# Altium project Panel.PrjPCB
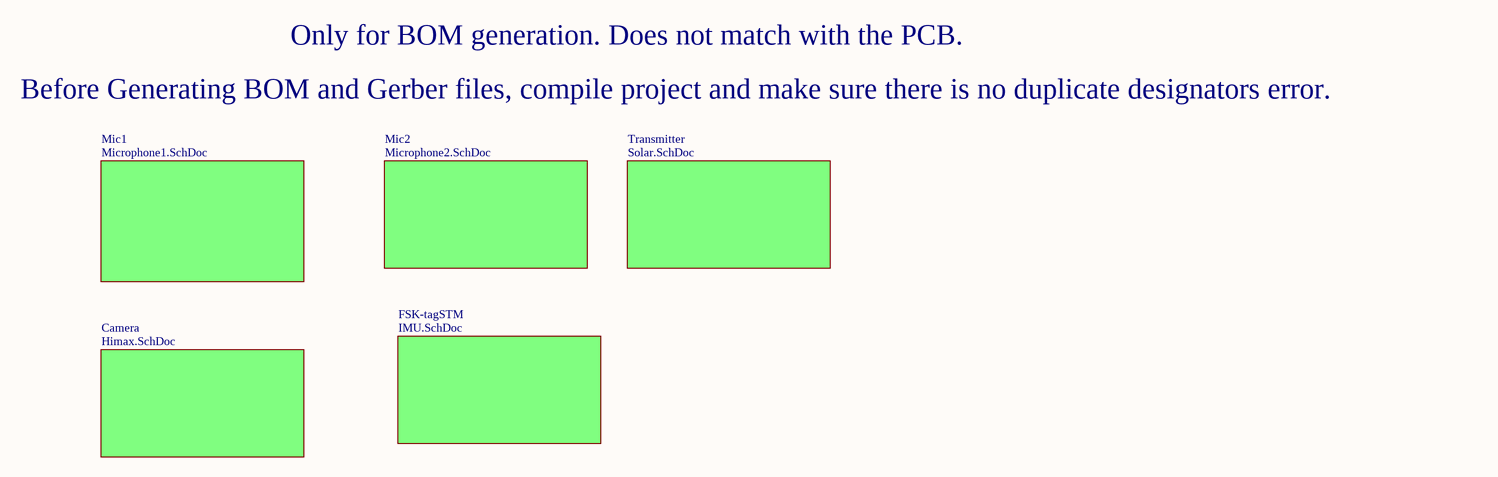
[diagram p0: Tag-panel.SchDoc]
6 sheets, 106 parts. Net scope: flat (ports and power ports of the same name join across sheets).
Board files: Tag-Panel-V.PcbDoc, IMU.PcbDoc, Himax.PcbDoc, Microphone1.PcbDoc, Microphone2.PcbDoc, Solar.PcbDoc
Sheets:
  Tag-panel.SchDoc
    FSK-tagSTM = IMU.SchDoc
    Transmitter = Solar.SchDoc
    Camera = Himax.SchDoc
    Mic2 = Microphone2.SchDoc
    Mic1 = Microphone1.SchDoc

## Sheet Tag-panel.SchDoc
size Letter; Author: Mohamad Katanbaf; Organization: University of Washington; Address1: Sensor Systems Lab; Address2: Paul Allen Center,; Address3: 185 E Stevens Way NE; Address4: Seattle, WA, 98105; Revision: 1.0

### Sub-sheets
Camera = Himax.SchDoc: no entries
FSK-tagSTM = IMU.SchDoc: no entries
Mic1 = Microphone1.SchDoc: no entries
Mic2 = Microphone2.SchDoc: no entries
Transmitter = Solar.SchDoc: no entries

### Notes on the sheet
- Only for BOM generation. Does not match with the PCB.
- Before Generating BOM and Gerber files, compile project and make sure there is no duplicate designators error.
- Title
- Date:
- Project
- Revision:
- Sheet
- of
- Author:

## Sheet IMU.SchDoc: ICM20602 Test Board
size Letter; Author: Mohamad Katanbaf; Organization: University of Washington; Address1: Sensor Systems Lab; Address2: Paul Allen Center,; Address3: 185 E Stevens Way NE; Address4: Seattle, WA, 98105; Revision: 1.0; SheetNumber: 1; SheetTotal: 1
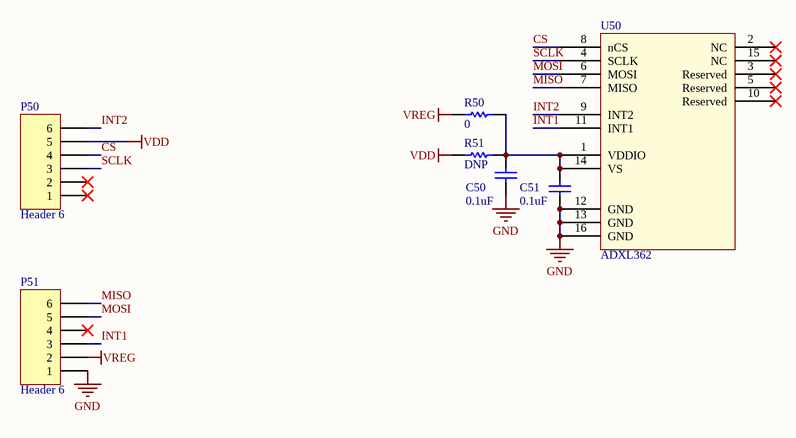
[diagram p1: IMU.SchDoc]

### Parts
C50  value 0.1uF  [0402]  (hidden comment: Generic ceramic capacitor)
C51  value 0.1uF  [0402]  (hidden comment: Generic ceramic capacitor)
P50  Header 6  [HDR1X6]
P51  Header 6  [HDR1X6]
R50  value 0  [0402]  (hidden comment: Generic resistor)
R51  value DNP  [0402]  (hidden comment: Generic resistor)
U50  ADXL362  [ADXL362]

### Nets
GND: C50.1 C51.1 P51.1 U50.12(GND) U50.13(GND) U50.16(GND)
VDD: P50.5 R51.1
VREG: P51.2 R50.1
CS: P50.4 U50.8(nCS)
INT1: P51.3 U50.11(INT1)
INT2: P50.6 U50.9(INT2)
MISO: P51.6 U50.7(MISO)
MOSI: P51.5 U50.6(MOSI)
SCLK: P50.3 U50.4(SCLK)
NetC50_2: C50.2 C51.2 R50.2 R51.2 U50.1(VDDIO) U50.14(VS)

Not connected (* = marked no-connect by the designer): P50 1* 2*; P51 4*; U50 2(NC)* 3(Reserved)* 5(Reserved)* 10(Reserved)* 15(NC)*

### Notes on the sheet
- Title
- Date:
- Project
- Revision:
- Sheet
- of
- Author:

### Library data of the parts
C50 C51 = C-0.1uF-10V-X5R-0402: CAP CER 100nF/0.1UF 10V X5R 0402; Manufacturer: Samsung Electro-Mechanics; Manufacturer Part Number: CL05A104KP5NNNC; Rating: 10V, -55C~85C; Tolerance: +-10%; Digi-Key Part Number: 1276-1022-1-ND; Note: *
P50 P51 = Header 6: Header, 6-Pin; LatestRevisionDate: 17-Jul-2002; LatestRevisionNote: Re-released for DXP Platform.; Publisher: Altium Limited
R50 = R-0-0.063W-*-0402: RES 0 OHM JUMPER 1/16W 0402; Manufacturer: YAGEO; Manufacturer Part Number: RC0402JR-070RL; Digi-Key Part Number: 311-0.0JRCT-ND; Rating: 1/16W; Note: *; Tolerance: *
R51 = res: Chip Resistor (Surface Mount); Manufacturer: *; Manufacturer Part Number: *; Digi-Key Part Number: *; Rating: *; Note: *; Tolerance: *
U50 = ADXL362: Analog Devices low power accelerometer; Manufacturer: Analog Devices Inc.; Manufacturer Part Number: ADXL362BCCZ-RL; Rating: 1.6~3.5V, -40~85C; Digi-Key Part Number: 505-ADXL362BCCZ-RLCT-ND; Note: *

## Sheet Solar.SchDoc: Dual Harvester
size Letter; Author: Ali Saffari; Organization: University of Washington; Address1: Sensor Systems Lab; SheetNumber: 1; SheetTotal: 3
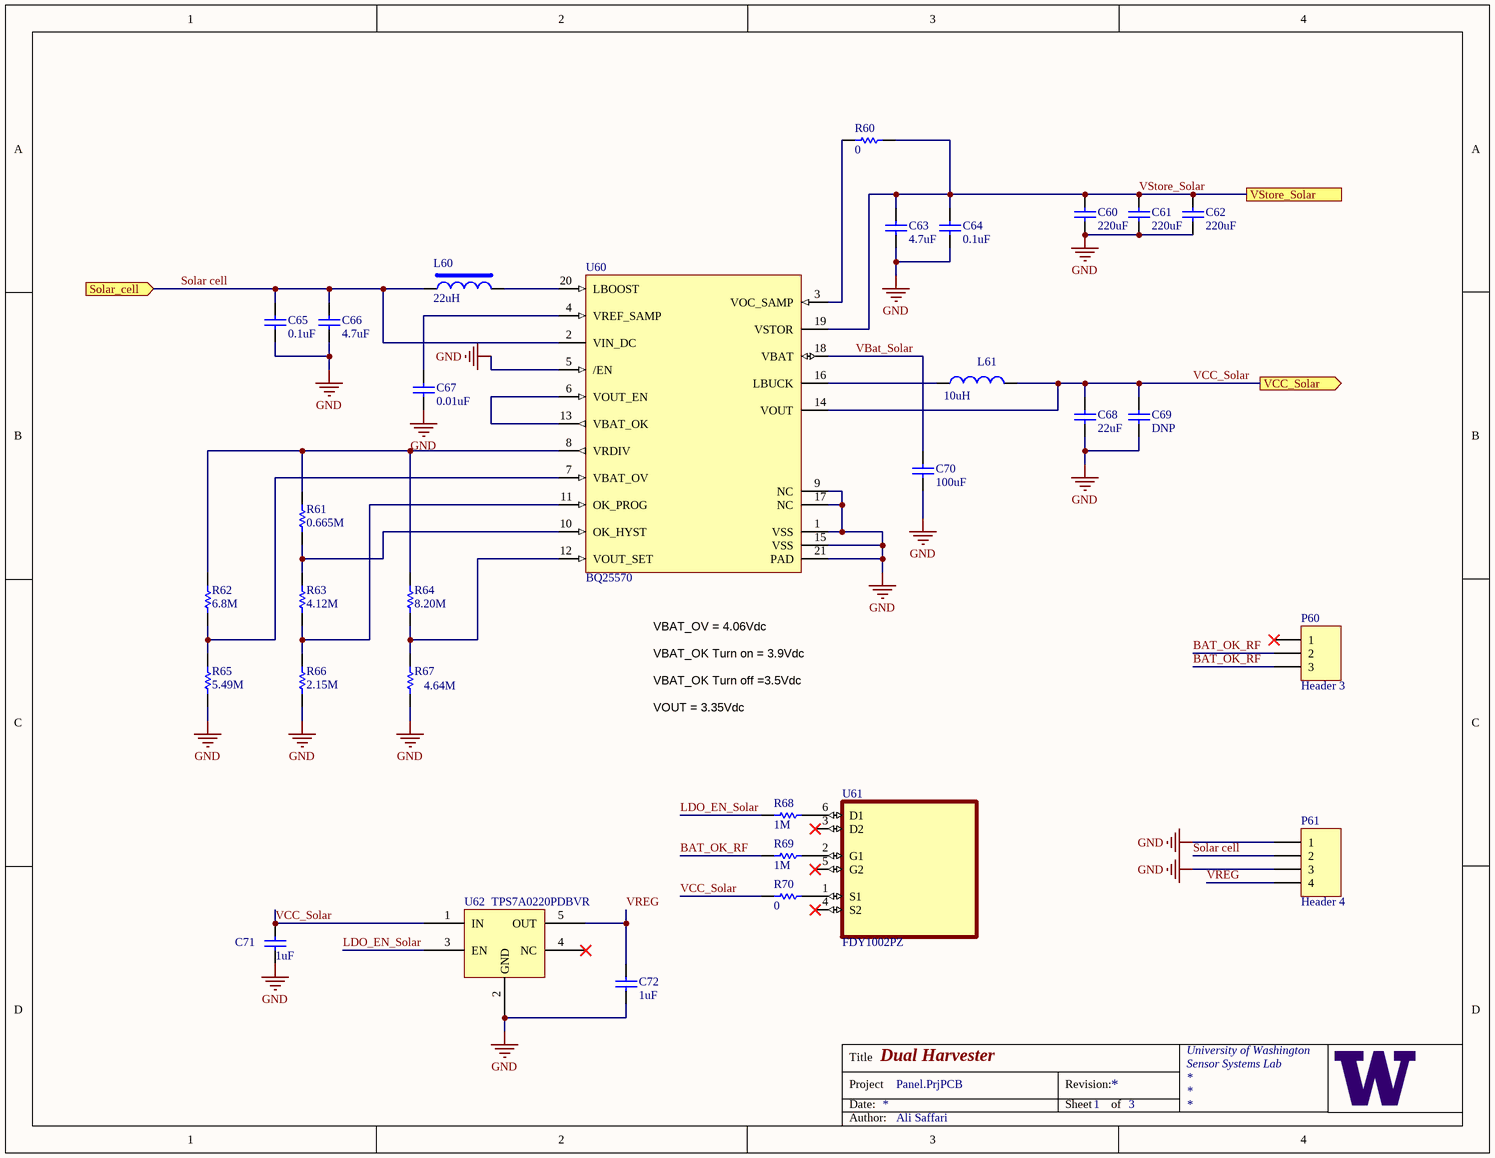
[diagram p2: Solar.SchDoc]

### Parts
C60  220uF  [1206]
C61  220uF  [1206]
C62  220uF  [1206]
C63  4.7uF  [0402]
C64  0.1uF  [0402]
C65  0.1uF  [0402]
C66  4.7uF  [0402]
C67  0.01uF  [0402]
C68  22uF  [0402]
C69  DNP  [0402]
C70  100uF  [0805]
C71  value 1uF  [0402]  (hidden comment: Cap)
C72  value 1uF  [0402]  (hidden comment: Cap)
L60  value 22uH  [LPS4018]  (hidden comment: Ind_LPS4018)
L61  10uH  [IND1008]
P60  Header 3  [HDR1X3]
P61  Header 4  [HDR1X4]
R60  0  [0402]
R61  0.665M  [0402]
R62  6.8M  [0402]
R63  4.12M  [0402]
R64  8.20M  [0402]
R65  5.49M  [0402]
R66  2.15M  [0402]
R67  4.64M  [0402]
R68  1M  [0402]
R69  1M  [0402]
R70  0  [0402]
U60  BQ25570  [BQ25570]
U61  FDY1002PZ  [SOT50P160X60-6N]
U62  TPS7A0220PDBVR  [SOT23-5]

### Ports
Solar_cell (in), VCC_Solar (out), VStore_Solar

### Nets
GND: C60.1 C61.1 C62.1 C63.1 C64.1 C65.1 C66.1 C67.1 C68.1 C69.1 C70.1 C71.1 C72.1 P61.1 P61.3 R65.2 R66.2 R67.2 U60.1(VSS) U60.5(/EN) U60.9(NC) U60.15(VSS) U60.17(NC) U60.21(PAD) U62.2(GND)
BAT_OK_RF: P60.2 P60.3 R69.1
LDO_EN_Solar: R68.1 U62.3(EN)
Solar cell: C65.2 C66.2 L60.1 P61.2 U60.2(VIN_DC) ; port Solar_cell
VBat_Solar: C70.2 U60.18(VBAT)
VCC_Solar: C68.2 C69.2 C71.2 L61.2 R70.1 U60.14(VOUT) U62.1(IN) ; port VCC_Solar
VREG: C72.2 P61.4 U62.5(OUT)
VStore_Solar: C60.2 C61.2 C62.2 C63.2 C64.2 R60.2 U60.19(VSTOR) ; port VStore_Solar
NetC67_2: C67.2 U60.4(VREF_SAMP)
NetL60_2: L60.2 U60.20(LBOOST)
NetL61_1: L61.1 U60.16(LBUCK)
NetR60_1: R60.1 U60.3(VOC_SAMP)
NetR61_1: R61.1 R62.1 R64.1 U60.8(VRDIV)
NetR61_2: R61.2 R63.1 U60.10(OK_HYST)
NetR62_2: R62.2 R65.1 U60.7(VBAT_OV)
NetR63_2: R63.2 R66.1 U60.11(OK_PROG)
NetR64_2: R64.2 R67.1 U60.12(VOUT_SET)
NetR68_2: R68.2 U61.6(D1)
NetR69_2: R69.2 U61.2(G1)
NetR70_2: R70.2 U61.1(S1)
NetU60_6: U60.6(VOUT_EN) U60.13(VBAT_OK)

Not connected (* = marked no-connect by the designer): P60 1*; U61 3(D2)* 4(S2)* 5(G2)*; U62 4(NC)*

### Notes on the sheet
- VBAT_OV = 4.06Vdc
- VBAT_OK Turn on = 3.9Vdc
- VBAT_OK Turn off =3.5Vdc
- VOUT = 3.35Vdc
- Title
- Date:
- Project
- Revision:
- Sheet
- of
- Author:

### Library data of the parts
C60-C62 = Cap: Ceramic Capacitor (Surface Mount); Manufacturer: Murata Electronics; Manufacturer Part Number: GRM31CR60J227ME11L; Rating: 6.3V; Note: CAP CER 220UF 6.3V X5R 1206; Digi-Key Part Number: 490-13970-1-ND; Value: 220uF
C63 C66 C67 = Cap: Ceramic Capacitor (Surface Mount); Manufacturer: Murata Electronics; Manufacturer Part Number: GRM155R61A475MEAAD; Rating: 10V; Note: CAP CER 4.7UF 10V X5R 0402; Digi-Key Part Number: 490-14306-1-ND
  C63 C66: Value: 4.7uF
  C67: Value: 0.01uF
C64 C65 = Cap: Ceramic Capacitor (Surface Mount); Manufacturer: Murata Electronics North America; Manufacturer Part Number: GCM155R71C104KA55D; Rating: 16V; Note: CAP CER 0.1UF 16V X7R 0402; Digi-Key Part Number: 490-4759-1-ND; Value: 0.1uF
C68 C69 = Cap: Ceramic Capacitor (Surface Mount); Manufacturer: Murata Electronics; Manufacturer Part Number: GRM188R61A226ME15D; Rating: 10V; Note: CAP CER 22UF 10V X5R 0603; Digi-Key Part Number: 490-10476-1-ND
  C68: Value: 22uF
  C69: Value: DNP
C70 = Cap: Ceramic Capacitor (Surface Mount); Manufacturer: Murata Electronics; Manufacturer Part Number: GRM21BR60J107ME15L; Rating: 6.3V; Note: CAP CER 100UF 6.3V X5R 0805; Digi-Key Part Number: 490-13981-1-ND; Value: 100uF
C71 C72 = Cap: Ceramic Capacitor (Surface Mount); Manufacturer: Generic Ceramic Chip Cap (TBD); Digi-Key Part Number: *; Manufacturer Part Number: *; Note: *; Rating: *
L60 = Ind_LPS4018: Inductor (Surface Mount); Manufacturer: Coil Craft; Manufacturer Part Number: LPS4018-223MRB; Rating: 0.9A; Note: LPS4018 Low Profile 22uH 0.9A 20% SMD; Digi-Key Part Number: *
L61 = Ind: Inductor (Surface Mount); Manufacturer: Murata Electronics; Manufacturer Part Number: 1239AS-H-100M=P2; Rating: 1A; Note: FIXED IND 10UH 1A 460 MOHM SMD; Value: 10uH; Digi-Key Part Number: 490-10563-1-ND
P60 = Header 3: Header, 3-Pin; LatestRevisionDate: 17-Jul-2002; LatestRevisionNote: Re-released for DXP Platform.; Publisher: Altium Limited
P61 = Header 4: Header, 4-Pin; LatestRevisionDate: 17-Jul-2002; LatestRevisionNote: Re-released for DXP Platform.; Publisher: Altium Limited
R60 R68-R70 = Res: Chip Resistor (Surface Mount); Manufacturer: Yageo; Manufacturer Part Number: RC0402JR-070RL; Rating: 1/16W; Digi-Key Part Number: 311-0.0JRCT-ND
  R60 R70: Value: 0
  R68 R69: Value: 1M
R61 = Res: Chip Resistor (Surface Mount); Manufacturer: Yageo; Manufacturer Part Number: RC0402FR-073M3L; Rating: 1/16W; Digi-Key Part Number: 311-3.30MLRCT-ND; Value: 0.665M
R62 R64 = Res: Chip Resistor (Surface Mount); Manufacturer: Vishay Dale; Manufacturer Part Number: CRCW04026M80JNED; Rating: 1/16W; Digi-Key Part Number: 541-6.8MJCT-ND
  R62: Value: 6.8M
  R64: Value: 8.20M
R63 R65 R67 = Res: Chip Resistor (Surface Mount); Manufacturer: Vishay Dale; Manufacturer Part Number: CRCW04025M49FKED; Rating: 1/16W; Digi-Key Part Number: 541-5.49MLCT-ND
  R63: Value: 4.12M
  R65: Value: 5.49M
  R67: Value: 4.64M
R66 = Res: Chip Resistor (Surface Mount); Manufacturer: Vishay Dale; Manufacturer Part Number: CRCW04024M22FKED; Rating: 1/16W; Digi-Key Part Number: 541-4.22MLCT-ND; Value: 2.15M
U60 = BQ25570: nano power boost charger and buck converter / for energy harvester powered applications; Manufacturer: Texas Instruments; Manufacturer Part Number: BQ25570RGRT; Output Current: 100mA; Operating Supply Current: 488nA; Min Supply Voltage: 100mV; Max Supply Voltage: 5.1V; Switching Frequency: 1MHz; Digi-Key Part Number: 296-37014-1-ND; Supplier 1: Digi-Key; Stock 1: 2223; Pricing 1: 1=7.94, 10=7.171, 25=6.8372, 100=5.6697 (USD); Mount: Surface Mount; Case/Package: VQFN; Number of Pins: 20; Contact Plating: Gold; Min Operating Temperature: -40°C; Max Operating Temperature: 125°C; Package Quantity: 250; Packaging: Tape and Reel; Radiation Hardening: No; REACH SVHC: No SVHC; Lead Free: Lead Free; ComponentLink1URL: http://www.mouser.com/ds/2/405/bq25570-556801.pdf?src-supplier=Mouser; ComponentLink1Description: http://www.mouser.com/ds/2/405/bq25570-556801.pdf?src-supplier=Mouser; ComponentLink2URL: http://www.ti.com/lit/pdf/sluuaa7?src-supplier=Digi-Key; ComponentLink2Description: http://www.ti.com/lit/pdf/sluuaa7?src-supplier=Digi-Key; ComponentLink3URL: http://www.farnell.com/datasheets/1904809.pdf?src-supplier=Element14; ComponentLink3Description: http://www.farnell.com/datasheets/1904809.pdf?src-supplier=Element14; ComponentLink4URL: http://www.ti.com/lit/ds/symlink/bq25570.pdf?src-supplier=Digi-Key; ComponentLink4Description: http://www.ti.com/lit/ds/symlink/bq25570.pdf?src-supplier=Digi-Key; ComponentLink5URL: http://www.ti.com/lit/ds/symlink/bq25570.pdf?src-supplier=Avnet; ComponentLink5Description: http://www.ti.com/lit/ds/symlink/bq25570.pdf?src-supplier=Avnet; ComponentLink6URL: http://www.ti.com/general/docs/lit/getliterature.tsp?genericPartNumber=BQ25570&&fileType=pdf&src-supplier=Avnet; ComponentLink6Description: http://www.ti.com/general/docs/lit/getliterature.tsp?genericPartNumber=BQ25570&&fileType=pdf&src-supplier=Avnet; Supplier Part Number 1: 296-37014-1-ND
U61 = FDY1002PZ: Mosfet Array 2 P-Channel (Dual) 20V 830mA 446mW Surface Mount SOT-563F; MF: ON Semiconductor; Value: *; Check_prices: https://www.snapeda.com/parts/FDY1002PZ/Onsemi/view-part/?ref=eda; Availability: In Stock; Price: None; MP: FDY1002PZ; Package: SOT-563-6 ON Semiconductor; SnapEDA_Link: https://www.snapeda.com/parts/FDY1002PZ/Onsemi/view-part/?ref=snap; Purchase-URL: https://pricing.snapeda.com/search/part/FDY1002PZ/?ref=eda
U62 = TPS7A0218PDBVR: IC REG LINEAR 2V 200MA SOT23-5

## Sheet Himax.SchDoc: Himax Camera
size Letter; Author: Ali Saffari; Organization: University of Washington; Address1: Sensor Systems Lab; Revision: 2; SheetNumber: 1; SheetTotal: 1
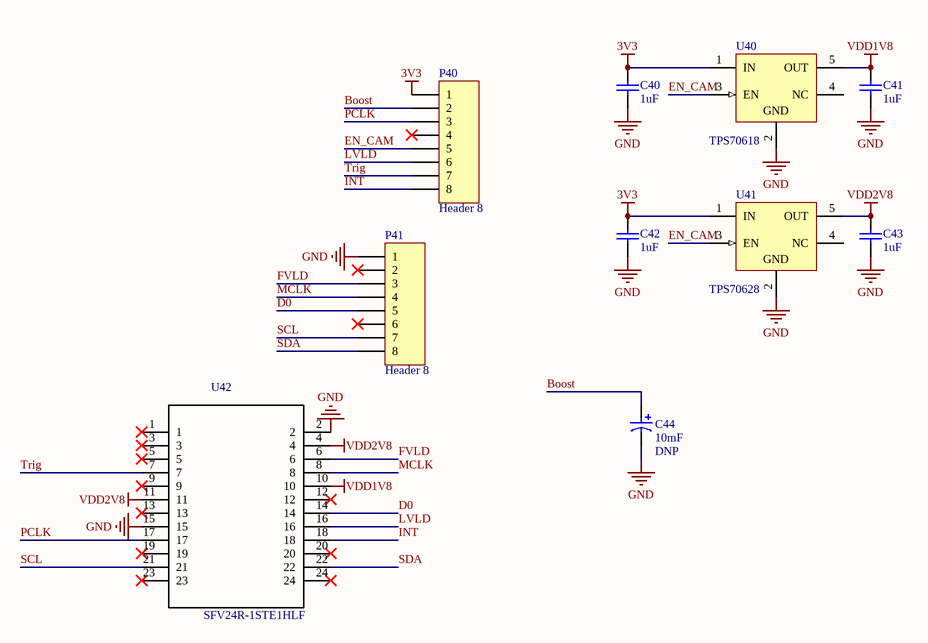
[diagram p3: Himax.SchDoc]

### Parts
C40  value 1uF  [0402]  (hidden comment: Generic ceramic capacitor)
C41  value 1uF  [0402]  (hidden comment: Generic ceramic capacitor)
C42  value 1uF  [0402]  (hidden comment: Generic ceramic capacitor)
C43  value 1uF  [0402]  (hidden comment: Generic ceramic capacitor)
C44  value DNP  Note: 10mF  [CAPPRD500W60D1000H3200]  (hidden comment: Generic electrolytic capacitor)
P40  Header 8  [HDR1X8]
P41  Header 8  [HDR1X8]
U40  TPS70618  [TI-DDC5_M]
U41  TPS70628  [TI-DDC5_M]
U42  SFV24R-1STE1HLF  [FCI_SFV24R-2STE1LF]

### Nets
3V3: C40.2 C42.2 P40.1 U40.1(IN) U41.1(IN)
GND: C40.1 C41.1 C42.1 C43.1 C44.N P41.1 U40.2(GND) U41.2(GND) U42.2 U42.15
VDD1V8: C41.2 U40.5(OUT) U42.10
VDD2V8: C43.2 U41.5(OUT) U42.4 U42.11
Boost: C44.P P40.2
D0: P41.5 U42.14
EN_CAM: P40.5 U40.3(EN) U41.3(EN)
FVLD: P41.3 U42.6
INT: P40.8 U42.18
LVLD: P40.6 U42.16
MCLK: P41.4 U42.8
PCLK: P40.3 U42.17
SCL: P41.7 U42.21
SDA: P41.8 U42.22
Trig: P40.7 U42.7

Not connected (* = marked no-connect by the designer): P40 4*; P41 2* 6*; U40 4(NC); U41 4(NC); U42 1* 3* 5* 9* 12* 13* 19* 20* 23* 24*

### Notes on the sheet
- Title
- Date:
- Project
- Revision:
- Sheet
- of
- Author:

### Library data of the parts
C40-C43 = C-1uF-10V-X5R-0402: CAP CER 1UF 10V X5R 0402; Manufacturer: Samsung Electro-Mechanics; Manufacturer Part Number: CL05A105KP5NNNC; Rating: 10V, -55~85C; Tolerance: +-10%; Digi-Key Part Number: 1276-1076-1-ND; Note: *
C44 = cap_electrolytic: Electrolytic capacitor; Digi-Key Part Number: *; Manufacturer: *; Manufacturer Part Number: *; Rating: *; Tolerance: *
P40 P41 = Header 8: Header, 8-Pin; LatestRevisionDate: 17-Jul-2002; LatestRevisionNote: Re-released for DXP Platform.; Publisher: Altium Limited
U40 = TPS706xx: Linear Voltage Regulator IC Positive Fixed 1 Output 150mA SOT-23-5; Manufacturer: Texas Instruments; Manufacturer Part Number: TPS70618DBVR; Number of Regulators: 1; Min Current Limit: 200mA; Quiescent Current: 1.3uA; Dropout Voltage: 245mV; Min Input Voltage: 2.7V; Max Input Voltage: 6.5V; Accuracy: 2%; ComponentLink3URL: http://www.ti.com/litv/pdf/mpds123d; ComponentLink1Description: Manufacturer URL; ComponentLink2URL: http://www.ti.com/general/docs/lit/getliterature.tsp?genericPartNumber=TPS78001&fileType=pdf; ComponentLink3Description: Package Specification; ComponentLink1URL: http://www.ti.com/; ComponentLink2Description: Datasheet; Mount: Surface Mount; Case/Package: SOT-23-5; Number of Pins: 5; Contact Plating: Gold; Min Operating Temperature: -40°C; Max Operating Temperature: 125°C; Packaging: Cut Tape; Output Voltage: *; Output Current: 150mA; Output Type: Fixed; Polarity: Positive; Number of Outputs: 1; Max Output Current: 150mA; Lead Free: Lead Free; REACH SVHC: No SVHC; Digi-Key Part Number: 296-47896-1-ND
U41 = TPS706xx: Linear Voltage Regulator IC Positive Fixed 1 Output 150mA SOT-23-5; Manufacturer: Texas Instruments; Manufacturer Part Number: TPS70628DBVR; Number of Regulators: 1; Min Current Limit: 200mA; Quiescent Current: 1.3uA; Dropout Voltage: 245mV; Min Input Voltage: 2.7V; Max Input Voltage: 6.5V; Accuracy: 2%; ComponentLink3URL: http://www.ti.com/litv/pdf/mpds123d; ComponentLink1Description: Manufacturer URL; ComponentLink2URL: http://www.ti.com/general/docs/lit/getliterature.tsp?genericPartNumber=TPS78001&fileType=pdf; ComponentLink3Description: Package Specification; ComponentLink1URL: http://www.ti.com/; ComponentLink2Description: Datasheet; Mount: Surface Mount; Case/Package: SOT-23-5; Number of Pins: 5; Contact Plating: Gold; Min Operating Temperature: -40°C; Max Operating Temperature: 125°C; Packaging: Cut Tape; Output Voltage: *; Output Current: 150mA; Output Type: Fixed; Polarity: Positive; Number of Outputs: 1; Max Output Current: 150mA; Lead Free: Lead Free; REACH SVHC: No SVHC; Digi-Key Part Number: 296-50141-1-ND
U42 = SFV24R-1STE1HLF: Himax Camera Connector; Manufacturer: Amphenol FCI; Actuator Material: Glass,Polyphenylene; Number of Contacts: 24; Contact Resistance: 30mR; Current Rating: 500mA; Voltage Rating: 50V; Contact Location: Bottom; Insulation Resistance: 100MR; Wire/Cable Type: Straight; Pitch: 0.5mm; Supplier 1: Digi-Key; Manufacturer Part Number: SFV24R-1STE1HLF; Stock 1: 0; Pricing 1: 1=0.76, 10=0.67, 25=0.6308, 50=0.6044, 100=0.5782, 250=0.5256, 500=0.47304, 1000=0.42048 (USD); Mount: Surface Mount; Contact Material: Bronze; Contact Plating: Tin; Housing Color: Black; Housing Material: Polymer; Min Operating Temperature: -55°C; Max Operating Temperature: 105°C; Number of Rows: 1; Termination: Solder; Orientation: Right Angle; Packaging: Tape and Reel; Package Quantity: 3000; Number of Positions: 24; Max Voltage Rating (AC): 50V; Max Voltage Rating (DC): 50V; Length: 17.5mm; Depth: 4.9mm; Radiation Hardening: No; Lead Free: Lead Free; Flammability Rating: UL94 V-0; ComponentLink1URL: http://portal.fciconnect.com/Comergent/fci/drawing/10112793.pdf?src-supplier=Avnet; ComponentLink1Description: http://portal.fciconnect.com/Comergent/fci/drawing/10112793.pdf?src-supplier=Avnet; ComponentLink2URL: https://cdn.amphenol-icc.com/media/wysiwyg/files/drawing/10112793.pdf?src-supplier=Digi-Key; ComponentLink2Description: https://cdn.amphenol-icc.com/media/wysiwyg/files/drawing/10112793.pdf?src-supplier=Digi-Key; ComponentLink3URL: http://portal.fciconnect.com/Comergent//fci/drawing/10112793.pdf?src-supplier=Mouser; ComponentLink3Description: http://portal.fciconnect.com/Comergent//fci/drawing/10112793.pdf?src-supplier=Mouser; Supplier Part Number 1: 609-4320-1-ND

## Sheet Microphone2.SchDoc: Microphone
size Letter; Author: Ali Saffari; Organization: University of Washinton; Address1: Sensor Systems Lab; Revision: 2; SheetNumber: 1; SheetTotal: 1
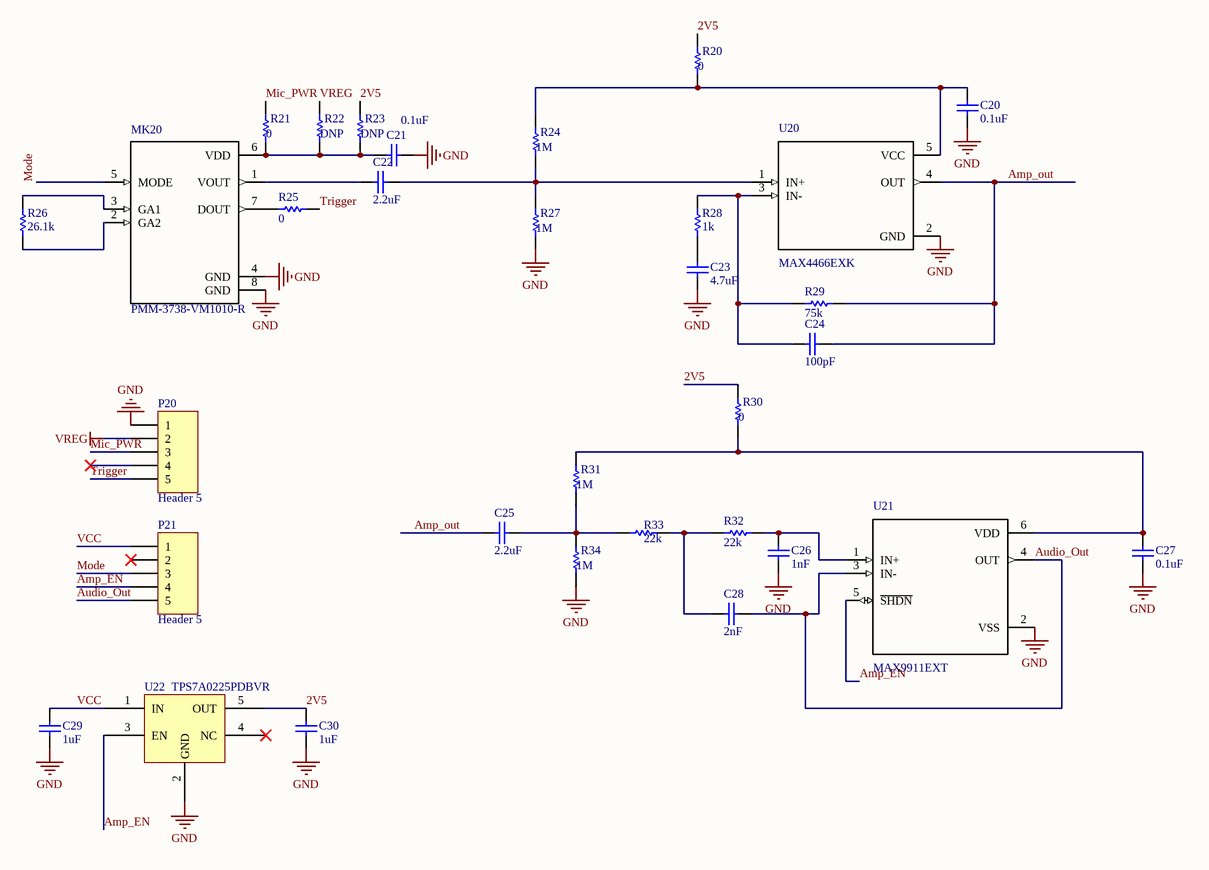
[diagram p4: Microphone2.SchDoc]

### Parts
C20  0.1uF  [0402]
C21  0.1uF  [0402]
C22  2.2uF  [0402]
C23  4.7uF  [0402]
C24  100pF  [0402]
C25  2.2uF  [0402]
C26  1nF  [0402]
C27  0.1uF  [0402]
C28  2nF  [0402]
C29  1uF  [0402]
C30  1uF  [0402]
MK20  PMM-3738-VM1010-R  [MIC_PMM-3738-VM1010-R]
P20  Header 5  [HDR1X5]
P21  Header 5  [HDR1X5]
R20  0  [0402]
R21  0  [0402]
R22  DNP  [0402]
R23  DNP  [0402]
R24  1M  [0402]
R25  0  [0402]
R26  26.1k  [0402]
R27  1M  [0402]
R28  1k  [0402]
R29  75k  [0402]
R30  0  [0402]
R31  1M  [0402]
R32  22k  [0402]
R33  22k  [0402]
R34  1M  [0402]
U20  MAX4466EXK  [SOT65P210X110-5N]
U21  MAX9911EXT  [MAX9911EXT]
U22  TPS7A0225PDBVR  [SOT23-5]

### Nets
GND: C20.2 C21.2 C23.1 C26.2 C27.1 C29.1 C30.1 MK20.4(GND) MK20.8(GND) P20.1 R27.2 R34.1 U20.2(GND) U21.2(VSS) U22.2(GND)
VREG: P20.2 R22.1
2V5: C30.2 R20.1 R23.1 R30.1 U22.5(OUT)
Amp_EN: P21.4 U21.5(~{SHDN}) U22.3(EN)
Amp_out: C24.1 C25.1 R29.2 U20.4(OUT)
Audio_Out: C28.1 P21.5 U21.3(IN-) U21.4(OUT)
Mic_PWR: P20.3 R21.1
Mode: MK20.5(MODE) P21.3
Trigger: P20.5 R25.2
VCC: C29.2 P21.1 U22.1(IN)
NetC20_1: C20.1 R20.2 R24.1 U20.5(VCC)
NetC21_1: C21.1 MK20.6(VDD) R21.2 R22.2 R23.2
NetC22_1: C22.1 MK20.1(VOUT)
NetC22_2: C22.2 R24.2 R27.1 U20.1(IN+)
NetC23_2: C23.2 R28.2
NetC24_2: C24.2 R28.1 R29.1 U20.3(IN-)
NetC25_2: C25.2 R31.1 R33.1 R34.2
NetC26_1: C26.1 R32.2 U21.1(IN+)
NetC27_2: C27.2 R30.2 R31.2 U21.6(VDD)
NetC28_2: C28.2 R32.1 R33.2
NetMK20_2: MK20.2(GA2) R26.2
NetMK20_3: MK20.3(GA1) R26.1
NetMK20_7: MK20.7(DOUT) R25.1

Not connected (* = marked no-connect by the designer): P20 4*; P21 2*; U22 4(NC)*

### Notes on the sheet
- Title
- Date:
- Project
- Revision:
- Sheet
- of
- Author:

### Library data of the parts
C20 C21 C27 = Cap: Ceramic Capacitor (Surface Mount); Manufacturer: Murata Electronics North America; Manufacturer Part Number: GCM155R71C104KA55D; Note: CAP CER 0.1UF 16V X7R 0402; Rating: 16V; Digi-Key Part Number: 490-4759-1-ND; Value: 0.1uF
C22 C25 C29 C30 = Cap: Ceramic Capacitor (Surface Mount); Manufacturer: Yageo; Manufacturer Part Number: RC0402JR-070RL; Digi-Key Part Number: 311-0.0JRCT-ND; Note: *; Rating: *
  C22 C25: Value: 2.2uF
  C29 C30: Value: 1uF
C23 = Cap: Ceramic Capacitor (Surface Mount); Manufacturer: Murata Electronics; Manufacturer Part Number: GRM155R61A475MEAAD; Note: CAP CER 4.7UF 10V X5R 0402; Rating: 10V; Digi-Key Part Number: 490-14306-1-ND; Value: 4.7uF
C24 = Cap: Ceramic Capacitor (Surface Mount); Manufacturer: Yageo; Manufacturer Part Number: CC0402JRNPO9BN101; Digi-Key Part Number: 311-1024-1-ND; Note: *; Rating: *; Value: 100pF
C26 = Cap: Ceramic Capacitor (Surface Mount); Manufacturer: Murata Electronics; Manufacturer Part Number: GCM155R71H102KA37D; Note: CAP CER 1000PF 50V X7R 0402; Rating: 50V; Digi-Key Part Number: 490-4761-1-ND; Value: 1nF
C28 = Cap: Ceramic Capacitor (Surface Mount); Manufacturer: AVX Corporation; Manufacturer Part Number: 04025C202JAT2A; Digi-Key Part Number: 478-10122-1-ND; Note: *; Rating: *; Value: 2nF
MK20 = PMM-3738-VM1010-R: MEMS Microphone Omni-Directional 700 Ohm -38dBV 1.8V Rectangular Solder Pad T/R; Manufacturer Part Number: VM1010; Manufacturer: Vesper Technologies Inc.; Notes: PIEZOELETRIC MEMS MIC SINGLE-END; Digi-Key Part Number: 2022-1001-1-ND
P20 P21 = Header 5: Header, 5-Pin; LatestRevisionDate: 17-Jul-2002; LatestRevisionNote: Re-released for DXP Platform.; Publisher: Altium Limited
R20-R23 R30 = Res: Chip Resistor (Surface Mount); Manufacturer: Yageo; Manufacturer Part Number: RC0402FR-071ML; Digi-Key Part Number: 311-1.00MLRCT-ND; Rating: *
  R20 R21 R30: Value: 0
  R22 R23: Value: DNP
R24 R27 R31 R34 = Res: Chip Resistor (Surface Mount); Manufacturer: Yageo; Manufacturer Part Number: RC0402FR-071ML; Value: DNP; Digi-Key Part Number: 311-1.00MLRCT-ND; Rating: *
R25 = Res: Chip Resistor (Surface Mount); Manufacturer: Yageo; Manufacturer Part Number: RC0402JR-070RL; Digi-Key Part Number: 311-0.0JRCT-ND; Rating: *; Value: 0
R26 = Res: Chip Resistor (Surface Mount); Manufacturer: Yageo; Manufacturer Part Number: RC0402FR-0726K1L; Digi-Key Part Number: 311-26.1KLRCT-ND; Rating: *; Value: 26.1k
R28 = Res: Chip Resistor (Surface Mount); Manufacturer: Yageo; Manufacturer Part Number: RC0402FR-071KL; Digi-Key Part Number: 311-1.00KLRCT-ND; Rating: *; Value: 1k
R29 = Res: Chip Resistor (Surface Mount); Manufacturer: Yageo; Manufacturer Part Number: RC0402FR-0775KL; Digi-Key Part Number: 311-75KLRCT-ND; Rating: *; Value: 75k
R32 R33 = Res: Chip Resistor (Surface Mount); Manufacturer: Yageo; Manufacturer Part Number: RT0402BRD0722KL; Digi-Key Part Number: YAG4210CT-ND; Rating: *; Value: 22k
U20 = MAX4466EXK: Audio Amp Microphone 1-CH Mono Class-AB 5-Pin SC70; Manufacturer: Maxim Integrated; Manufacturer Part Number: MAX4466EXK+T; Min Supply Voltage: 2.4V; Max Supply Voltage: 5.5V; Power Supply Rejection Ratio (PSRR): 112dB; Gain Bandwidth Product: 600kHz; Common Mode Rejection Ratio: 80dB; Max Power Dissipation: 200mW; Number of Channels: 1; Input Bias Current: 100nA; Input Offset Voltage (Vos): 5V; Supply Type: Single; Supplier 1: Digi-Key; Stock 1: 1912; Pricing 1: 1=0.86, 10=0.752, 25=0.7068, 100=0.5358, 250=0.456, 500=0.4332, 1000=0.3306 (USD); Mount: Surface Mount; Case/Package: SC; Number of Pins: 5; Weight: 0.000705oz; Contact Plating: Tin,Matte; Min Operating Temperature: -40°C; Max Operating Temperature: 85°C; Packaging: Tape and Reel; Package Quantity: 2500; Operating Supply Voltage: 5V; Length: 2mm; Height: 0.9mm; Width: 1.25mm; Radiation Hardening: No; REACH SVHC: Unknown; ComponentLink1URL: http://datasheets.maximintegrated.com/en/ds/MAX4465-MAX4469.pdf?src-supplier=Avnet; ComponentLink1Description: http://datasheets.maximintegrated.com/en/ds/MAX4465-MAX4469.pdf?src-supplier=Avnet; ComponentLink2URL: http://datasheets.maximintegrated.com/en/ds/MAX4465-MAX4469.pdf?src-supplier=Digi-Key; ComponentLink2Description: http://datasheets.maximintegrated.com/en/ds/MAX4465-MAX4469.pdf?src-supplier=Digi-Key; ComponentLink3URL: http://datasheets.maximintegrated.com/en/ds/MAX4465-MAX4469.pdf?src-supplier=Avnet+Europe; ComponentLink3Description: http://datasheets.maximintegrated.com/en/ds/MAX4465-MAX4469.pdf?src-supplier=Avnet+Europe; Supplier Part Number 1: MAX4466EXK+CT-ND
U21 = MAX9911EXT: Operational amplifier; 1.8Ã·5.5VDC; Channels: 1; SC70-6; Manufacturer Part Number: MAX9911EXT+T; Manufacturer: Maxim; Common Mode Rejection Ratio: 70dB; Number of Channels: 1; Output Current: 15mA; Slew Rate: 0.1V/µs; Nominal Supply Current: 4uA; Voltage Gain: 120dB; Min Supply Voltage: 1.8V; Max Supply Voltage: 5.5V; Bandwidth: 200kHz; Input Offset Voltage (Vos): 200uV; Input Bias Current: 1pA; Max Frequency: 1kHz; Max Power Dissipation: 245mW; Supplier 1: Digi-Key; Stock 1: 3380; Pricing 1: 1=1, 10=0.893, 25=0.848, 100=0.6511, 250=0.57536, 500=0.54508, 1000=0.51912 (USD); Mount: Surface Mount; Case/Package: SC; Number of Pins: 6; Contact Plating: Gold; Min Operating Temperature: -40°C; Max Operating Temperature: 85°C; Packaging: Tape and Reel; Package Quantity: 2500; Gain Bandwidth Product: 200kHz; Operating Supply Current: 4uA; Number of Circuits: 1; Output Current per Channel: 15mA; Number of Amplifiers: 1; Length: 2.15mm; Height: 1mm; Width: 1.35mm; Radiation Hardening: No; REACH SVHC: No SVHC; Lead Free: Lead Free; ComponentLink1URL: https://datasheets.maximintegrated.com/en/ds/MAX9910-MAX9913.pdf?src-supplier=Digi-Key; ComponentLink1Description: https://datasheets.maximintegrated.com/en/ds/MAX9910-MAX9913.pdf?src-supplier=Digi-Key; ComponentLink2URL: https://media.digikey.com/pdf/Data%20Sheets/Maxim%20PDFs/PartNumberBreakdown_ds.pdf?src-supplier=Digi-Key; ComponentLink2Description: https://media.digikey.com/pdf/Data%20Sheets/Maxim%20PDFs/PartNumberBreakdown_ds.pdf?src-supplier=Digi-Key; ComponentLink3URL: http://datasheets.maxim-ic.com/en/ds/MAX9910-MAX9913.pdf?src-supplier=Avnet+Europe; ComponentLink3Description: http://datasheets.maxim-ic.com/en/ds/MAX9910-MAX9913.pdf?src-supplier=Avnet+Europe; Supplier Part Number 1: MAX9911EXT+TCT-ND
U22 = TPS7A0218PDBVR: IC REG LINEAR 2.5V 200MA SOT23-5

## Sheet Microphone1.SchDoc: Microphone
size Letter; Author: Ali Saffari; Organization: University of Washinton; Address1: Sensor Systems Lab; Revision: 2; SheetNumber: 1; SheetTotal: 1
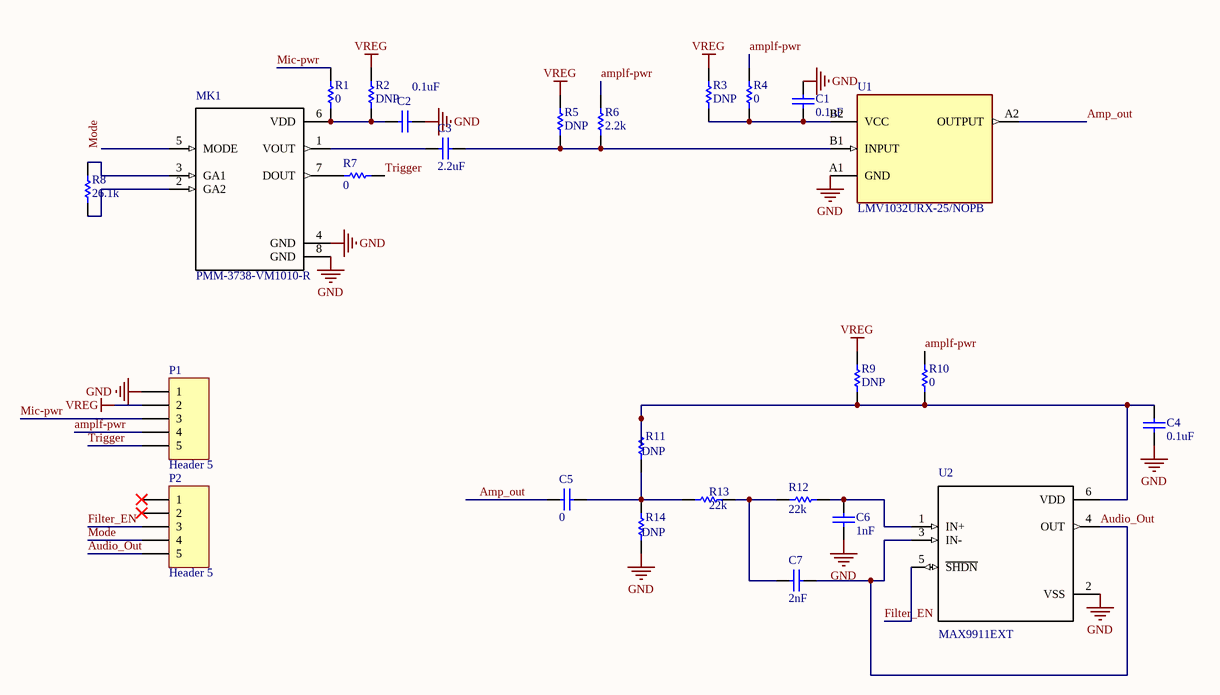
[diagram p5: Microphone1.SchDoc]

### Parts
C1  0.1uF  [0402]
C2  0.1uF  [0402]
C3  2.2uF  [0402]
C4  0.1uF  [0402]
C5  0  [0402]
C6  1nF  [0402]
C7  2nF  [0402]
MK1  PMM-3738-VM1010-R  [MIC_PMM-3738-VM1010-R]
P1  Header 5  [HDR1X5]
P2  Header 5  [HDR1X5]
R1  0  [0402]
R2  value DNP  [0402]  (hidden comment: Res)
R3  DNP  [0402]
R4  0  [0402]
R5  DNP  [0402]
R6  2.2k  [0402]
R7  0  [0402]
R8  26.1k  [0402]
R9  DNP  [0402]
R10  0  [0402]
R11  DNP  [0402]
R12  22k  [0402]
R13  22k  [0402]
R14  DNP  [0402]
U1  LMV1032URX-25/NOPB  [BGA4C2X2X50P_117X117X42]
U2  MAX9911EXT  [MAX9911EXT]

### Nets
GND: C1.2 C2.2 C4.1 C6.2 MK1.4(GND) MK1.8(GND) P1.1 R14.1 U1.A1(GND) U2.2(VSS)
VREG: P1.2 R2.2 R3.1 R5.1 R9.1
Amp_out: C5.1 U1.A2(OUTPUT)
amplf-pwr: P1.4 R4.1 R6.1 R10.1
Audio_Out: C7.1 P2.5 U2.3(IN-) U2.4(OUT)
Filter_EN: P2.3 U2.5(~{SHDN})
Mic-pwr: P1.3 R1.2
Mode: MK1.5(MODE) P2.4
Trigger: P1.5 R7.2
NetC1_1: C1.1 R3.2 R4.2 U1.B2(VCC)
NetC2_1: C2.1 MK1.6(VDD) R1.1 R2.1
NetC3_1: C3.1 MK1.1(VOUT)
NetC3_2: C3.2 R5.2 R6.2 U1.B1(INPUT)
NetC4_2: C4.2 R9.2 R10.2 R11.2 U2.6(VDD)
NetC5_2: C5.2 R11.1 R13.1 R14.2
NetC6_1: C6.1 R12.2 U2.1(IN+)
NetC7_2: C7.2 R12.1 R13.2
NetMK1_2: MK1.2(GA2) R8.2
NetMK1_3: MK1.3(GA1) R8.1
NetMK1_7: MK1.7(DOUT) R7.1

Not connected (* = marked no-connect by the designer): P2 1* 2*

### Notes on the sheet
- Title
- Date:
- Project
- Revision:
- Sheet
- of
- Author:

### Library data of the parts
C1 C2 C4 = Cap: as C20 on sheet Microphone2; Digi-Key Part Number: 490-4759-1-ND; Value: 0.1uF
C3 C5 = Cap: as C22 on sheet Microphone2; Digi-Key Part Number: 311-0.0JRCT-ND; Note: *; Rating: *
  C3: Value: 2.2uF
  C5: Value: 0
C6 = Cap: as C26 on sheet Microphone2; Digi-Key Part Number: 490-4761-1-ND; Value: 1nF
C7 = Cap: as C28 on sheet Microphone2; Digi-Key Part Number: 478-10122-1-ND; Note: *; Rating: *; Value: 2nF
MK1 = PMM-3738-VM1010-R: as MK20 on sheet Microphone2; Digi-Key Part Number: 2022-1001-1-ND
P1 P2 = Header 5: Header, 5-Pin; LatestRevisionDate: 17-Jul-2002; LatestRevisionNote: Re-released for DXP Platform.; Publisher: Altium Limited
R1 R2 = Res: Chip Resistor (Surface Mount); Manufacturer: Generic Chip Res (TBD); Manufacturer Part Number: *; Digi-Key Part Number: *; Rating: *
  R1: Value: 0
R3-R7 R9 R10 = Res: as R25 on sheet Microphone2; Digi-Key Part Number: 311-0.0JRCT-ND; Rating: *
  R3 R5 R9: Value: DNP
  R4 R7 R10: Value: 0
  R6: Value: 2.2k
R8 = Res: as R26 on sheet Microphone2; Digi-Key Part Number: 311-26.1KLRCT-ND; Rating: *; Value: 26.1k
R11 R14 = Res: as R20 on sheet Microphone2; Digi-Key Part Number: 311-1.00MLRCT-ND; Rating: *; Value: DNP
R12 R13 = Res: as R32 on sheet Microphone2; Digi-Key Part Number: YAG4210CT-ND; Rating: *; Value: 22k
U1 = LMV1032URX-25/NOPB: Analog input microphone preamplifier for 3-wire electret microphones; MF: Texas Instruments; SnapEDA_Link: https://www.snapeda.com/parts/LMV1032URX-25/NOPB/Texas+Instruments/view-part/?ref=snap; Price: None; Check_prices: https://www.snapeda.com/parts/LMV1032URX-25/NOPB/Texas+Instruments/view-part/?ref=eda; Purchase-URL: https://pricing.snapeda.com/search/part/LMV1032URX-25/NOPB/?ref=eda; Value: *; MP: LMV1032URX-25/NOPB; Package: DSBGA-4 Texas Instruments; Availability: In Stock
U2 = MAX9911EXT: as U21 on sheet Microphone2; Supplier 1: Digi-Key; Stock 1: 3380; Pricing 1: 1=1, 10=0.893, 25=0.848, 100=0.6511, 250=0.57536, 500=0.54508, 1000=0.51912 (USD); Mount: Surface Mount; Case/Package: SC; Number of Pins: 6; Contact Plating: Gold; Min Operating Temperature: -40°C; Max Operating Temperature: 85°C; Packaging: Tape and Reel; Package Quantity: 2500; Gain Bandwidth Product: 200kHz; Operating Supply Current: 4uA; Number of Circuits: 1; Output Current per Channel: 15mA; Number of Amplifiers: 1; Length: 2.15mm; Height: 1mm; Width: 1.35mm; Radiation Hardening: No; REACH SVHC: No SVHC; Lead Free: Lead Free; ComponentLink1URL: https://datasheets.maximintegrated.com/en/ds/MAX9910-MAX9913.pdf?src-supplier=Digi-Key; ComponentLink1Description: https://datasheets.maximintegrated.com/en/ds/MAX9910-MAX9913.pdf?src-supplier=Digi-Key; ComponentLink2URL: https://media.digikey.com/pdf/Data%20Sheets/Maxim%20PDFs/PartNumberBreakdown_ds.pdf?src-supplier=Digi-Key; ComponentLink2Description: https://media.digikey.com/pdf/Data%20Sheets/Maxim%20PDFs/PartNumberBreakdown_ds.pdf?src-supplier=Digi-Key; ComponentLink3URL: http://datasheets.maxim-ic.com/en/ds/MAX9910-MAX9913.pdf?src-supplier=Avnet+Europe; ComponentLink3Description: http://datasheets.maxim-ic.com/en/ds/MAX9910-MAX9913.pdf?src-supplier=Avnet+Europe; Supplier Part Number 1: MAX9911EXT+TCT-ND

## Nets that join several sheets
GND: IMU (6 pins), Solar (25 pins), Himax (10 pins), Microphone2 (15 pins), Microphone1 (10 pins)
VREG: IMU (P51.2 R50.1), Microphone2 (P20.2 R22.1), Microphone1 (5 pins)